# Altium schematic sheet Indication.SchDoc
size 420 x 297 mm; Address1: Address1; Address2: Address2; Address3: Address3; Address4: Address4; DocumentNumber: *Э3; SheetNumber: 7; SheetTotal: 14; DocumentType: Схема электрическая *
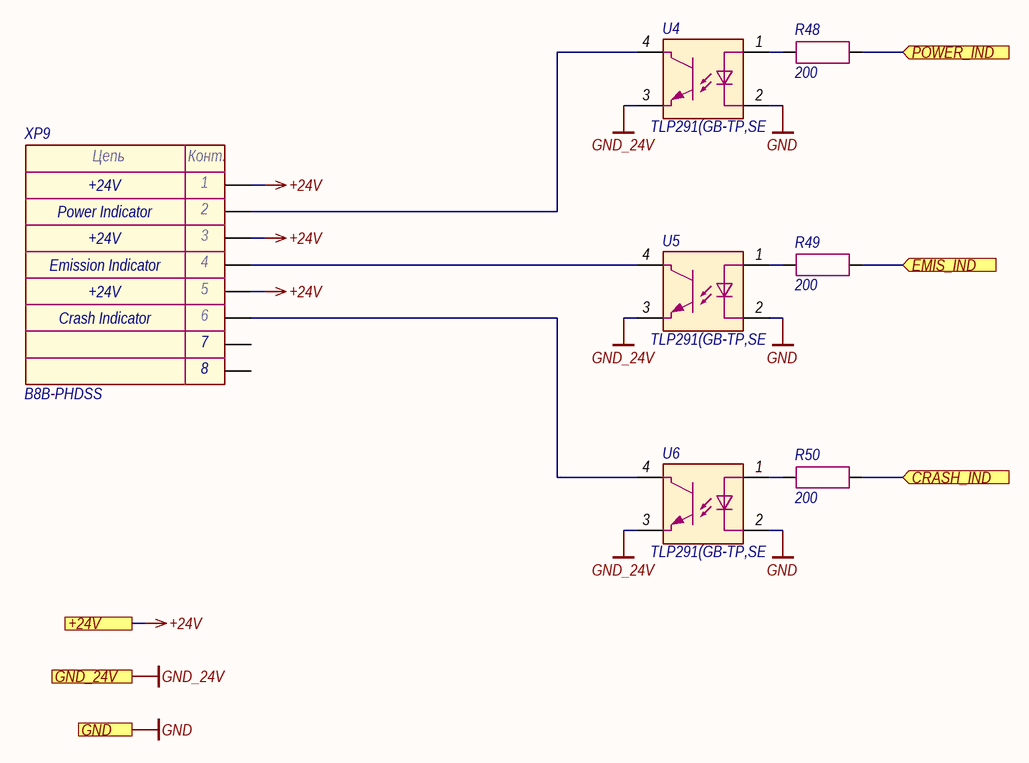
[diagram p0: Indication.SchDoc]

## Parts
R48  200  [RES_0603]
R49  200  [RES_0603]
R50  200  [RES_0603]
U4  TLP291(GB-TP,SE  [11-3C1]
U5  TLP291(GB-TP,SE  [11-3C1]
U6  TLP291(GB-TP,SE  [11-3C1]
XP9  B8B-PHDSS  [B8B-PHDSS]

## Ports
+24V (see Main[2C], Button[1C], Column[1C], Flow_sensor[2C], LD_driver[1D]), CRASH_IND (in, see Main[2C]), EMIS_IND (in, see Main[2C]), GND (see Main[2C], Button[1D], Column[1C], Ethernet[3D], Fiber_interlock[2C], Flow_sensor[2C], Guide_laser[1C], LD_driver[1D], Power_supply[2C], RS-485[2C]), GND_24V (see Main[2C], Button[1D], Column[1C], Flow_sensor[2C], LD_driver[1D]), POWER_IND (in, see Main[2C])

## Nets
+24V: XP9.1 XP9.3 XP9.5 ; port +24V
GND: U4.2 U5.2 U6.2 ; port GND
GND_24V: U4.3 U5.3 U6.3 ; port GND_24V
CRASH_IND: R50.2 ; port CRASH_IND
EMIS_IND: R49.2 ; port EMIS_IND
POWER_IND: R48.2 ; port POWER_IND
NetR48_1: R48.1 U4.1
NetR49_1: R49.1 U5.1
NetR50_1: R50.1 U6.1
NetU4_4: U4.4 XP9.2
NetU5_4: U5.4 XP9.4
NetU6_4: U6.4 XP9.6

Not connected (* = marked no-connect by the designer): XP9 7 8

## Notes on the sheet
- Power Indicator
- +24V
- (near XP9) Emission Indicator
- Crash Indicator
- Подп. и дата
- Инв. № дубл.
- Взам. инв. №
- Инв. № подл.
- Изм.
- Лист
- № докум.
- Подп.
- Дата
- Копировал
- Формат А3
- (in symbol Connector-8) Цепь; Конт.

## Library data of the parts
R48-R50 = Resistor: Manufacturer: Yageo; Model: RC0603FR-07200RL; Value: 200; Document: *
U4-U6 = TLP291: Manufacturer: Toshiba; Model: TLP291(GB-TP,SE; Document: *
XP9 = Connector-8: Manufacturer: JST; Model: B8B-PHDSS; Document: *